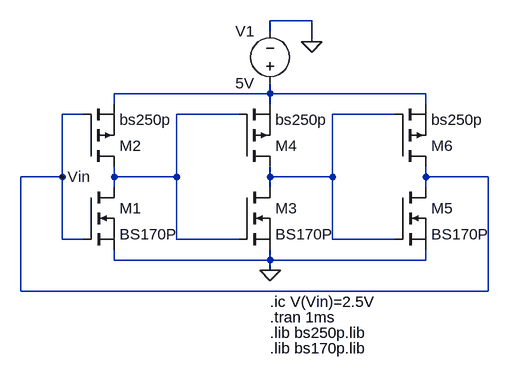
[diagram p0: schematic prelab3_task2.asc]
prelab3_task2.asc, the LTspice schematic file:
Version 4.1
SHEET 1 996 680
WIRE 720 64 656 64
WIRE 656 80 656 64
WIRE 720 96 720 64
WIRE 656 176 656 160
WIRE 656 176 416 176
WIRE 896 176 656 176
WIRE 416 192 416 176
WIRE 656 192 656 176
WIRE 896 192 896 176
WIRE 368 208 336 208
WIRE 608 208 512 208
WIRE 848 208 752 208
WIRE 336 304 336 208
WIRE 336 304 272 304
WIRE 416 304 416 288
WIRE 512 304 512 208
WIRE 512 304 416 304
WIRE 656 304 656 288
WIRE 752 304 752 208
WIRE 752 304 656 304
WIRE 896 304 896 288
WIRE 992 304 896 304
WIRE 416 320 416 304
WIRE 656 320 656 304
WIRE 896 320 896 304
WIRE 336 400 336 304
WIRE 368 400 336 400
WIRE 512 400 512 304
WIRE 608 400 512 400
WIRE 752 400 752 304
WIRE 848 400 752 400
WIRE 416 432 416 416
WIRE 656 432 656 416
WIRE 656 432 416 432
WIRE 896 432 896 416
WIRE 896 432 656 432
WIRE 656 448 656 432
WIRE 272 480 272 304
WIRE 992 480 992 304
WIRE 992 480 272 480
FLAG 656 448 0
FLAG 720 96 0
FLAG 336 304 Vin
SYMBOL nmos 368 320 R0
SYMATTR InstName M1
SYMATTR Value BS170P
SYMATTR Prefix X
SYMBOL pmos 368 288 M180
SYMATTR InstName M2
SYMATTR Value bs250p
SYMATTR Prefix X
SYMBOL nmos 608 320 R0
SYMATTR InstName M3
SYMATTR Value BS170P
SYMATTR Prefix X
SYMBOL pmos 608 288 M180
SYMATTR InstName M4
SYMATTR Value bs250p
SYMATTR Prefix X
SYMBOL nmos 848 320 R0
SYMATTR InstName M5
SYMATTR Value BS170P
SYMATTR Prefix X
SYMBOL pmos 848 288 M180
SYMATTR InstName M6
SYMATTR Value bs250p
SYMATTR Prefix X
SYMBOL voltage 656 176 R180
WINDOW 0 24 96 Left 2
WINDOW 3 24 16 Left 2
SYMATTR InstName V1
SYMATTR Value 5V
TEXT 656 496 Left 2 !.ic V(Vin)=2.5V
TEXT 656 520 Left 2 !.tran 1ms
TEXT 656 544 Left 2 !.lib bs250p.lib
TEXT 656 568 Left 2 !.lib bs170p.lib

The netlist it stands for:
* prelab3_task2.asc
X§M1 N002 Vin 0 BS170P  ; pins D G S
X§M2 N002 Vin N001 bs250p  ; pins D G S
X§M3 N003 N002 0 BS170P  ; pins D G S
X§M4 N003 N002 N001 bs250p  ; pins D G S
X§M5 Vin N003 0 BS170P  ; pins D G S
X§M6 Vin N003 N001 bs250p  ; pins D G S
V1 N001 0 5V
.ic V(Vin)=2.5V
.tran 1ms
.lib bs250p.lib
.lib bs170p.lib
.backanno
.end